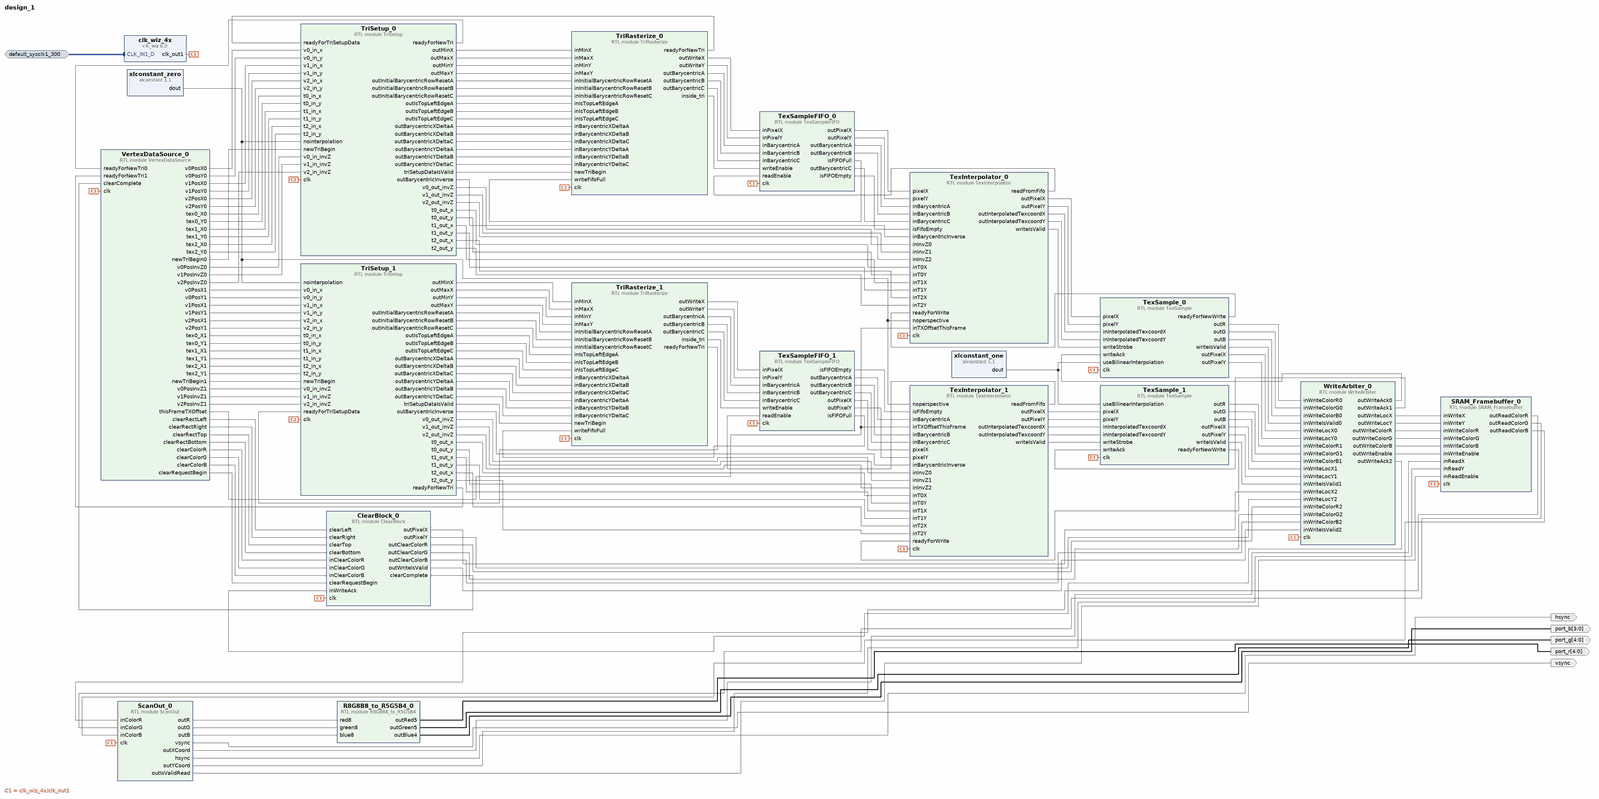
[diagram p0: block diagram of the top level, whole]
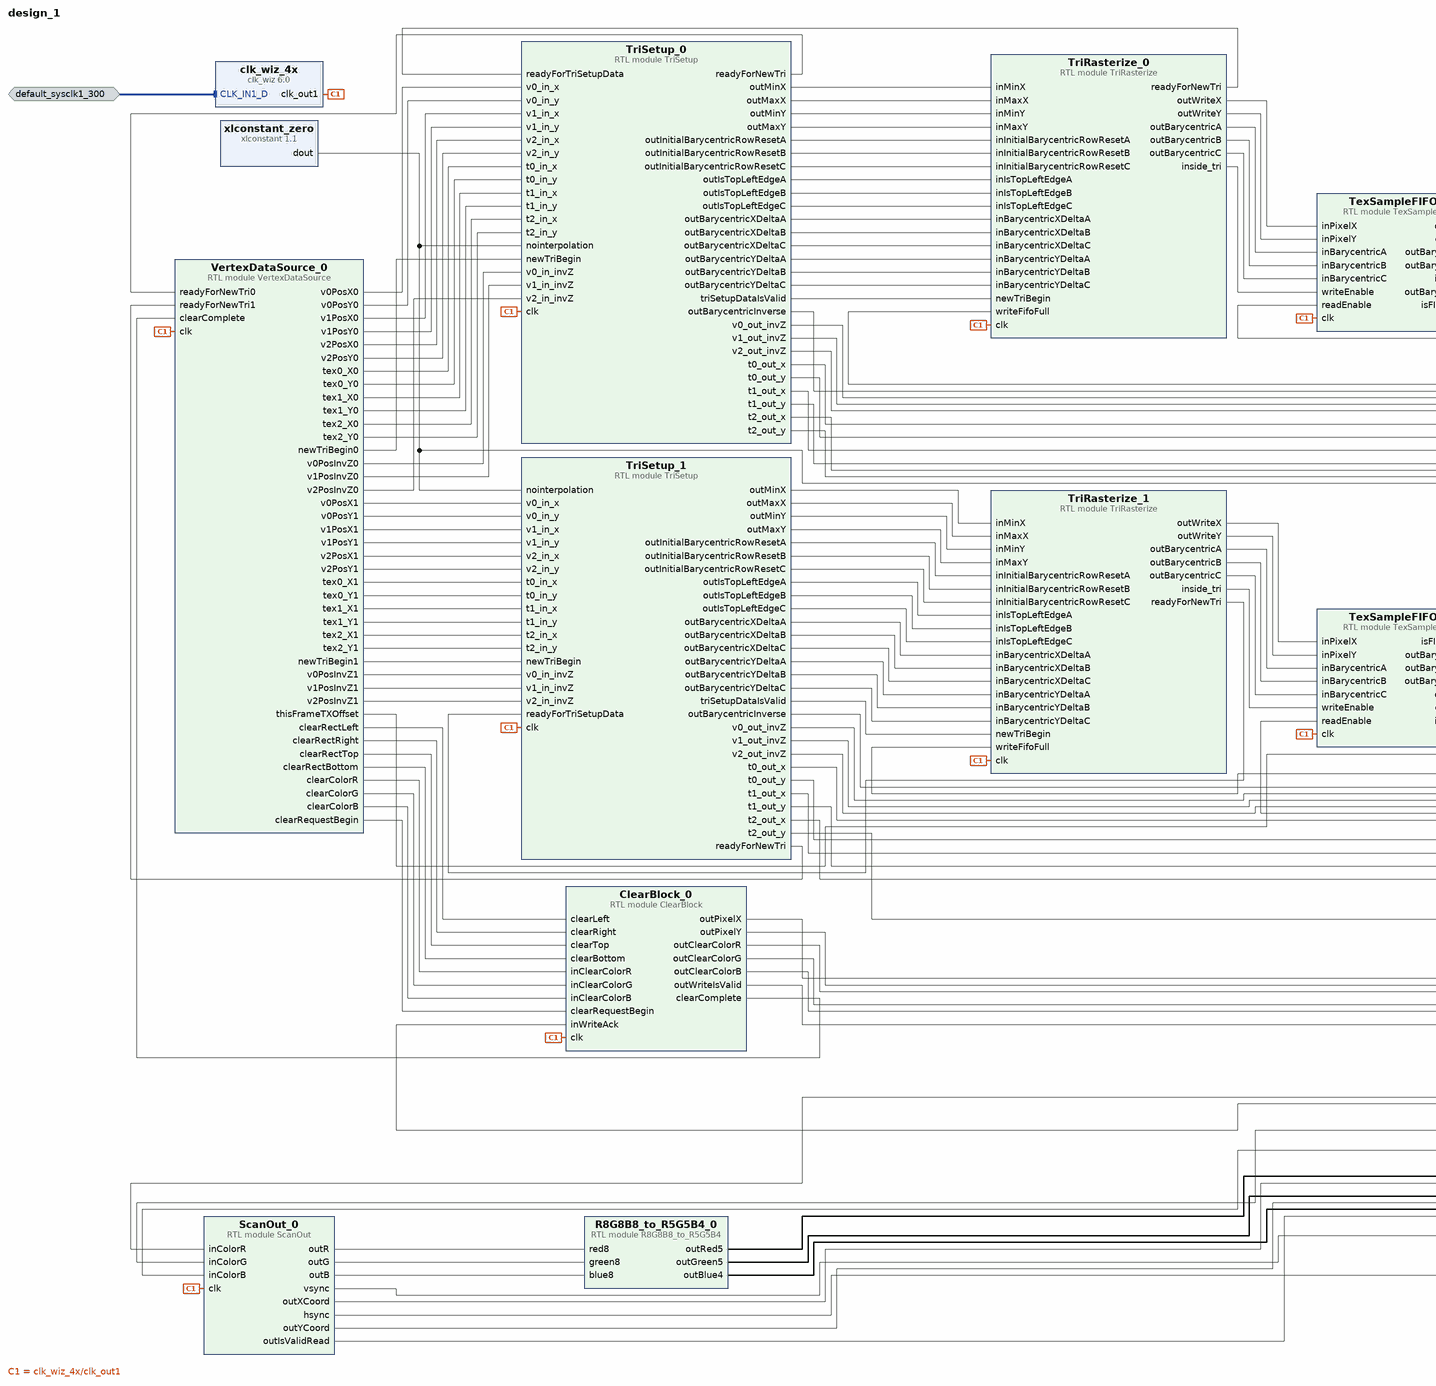
[diagram p1: block diagram of the top level, left part]
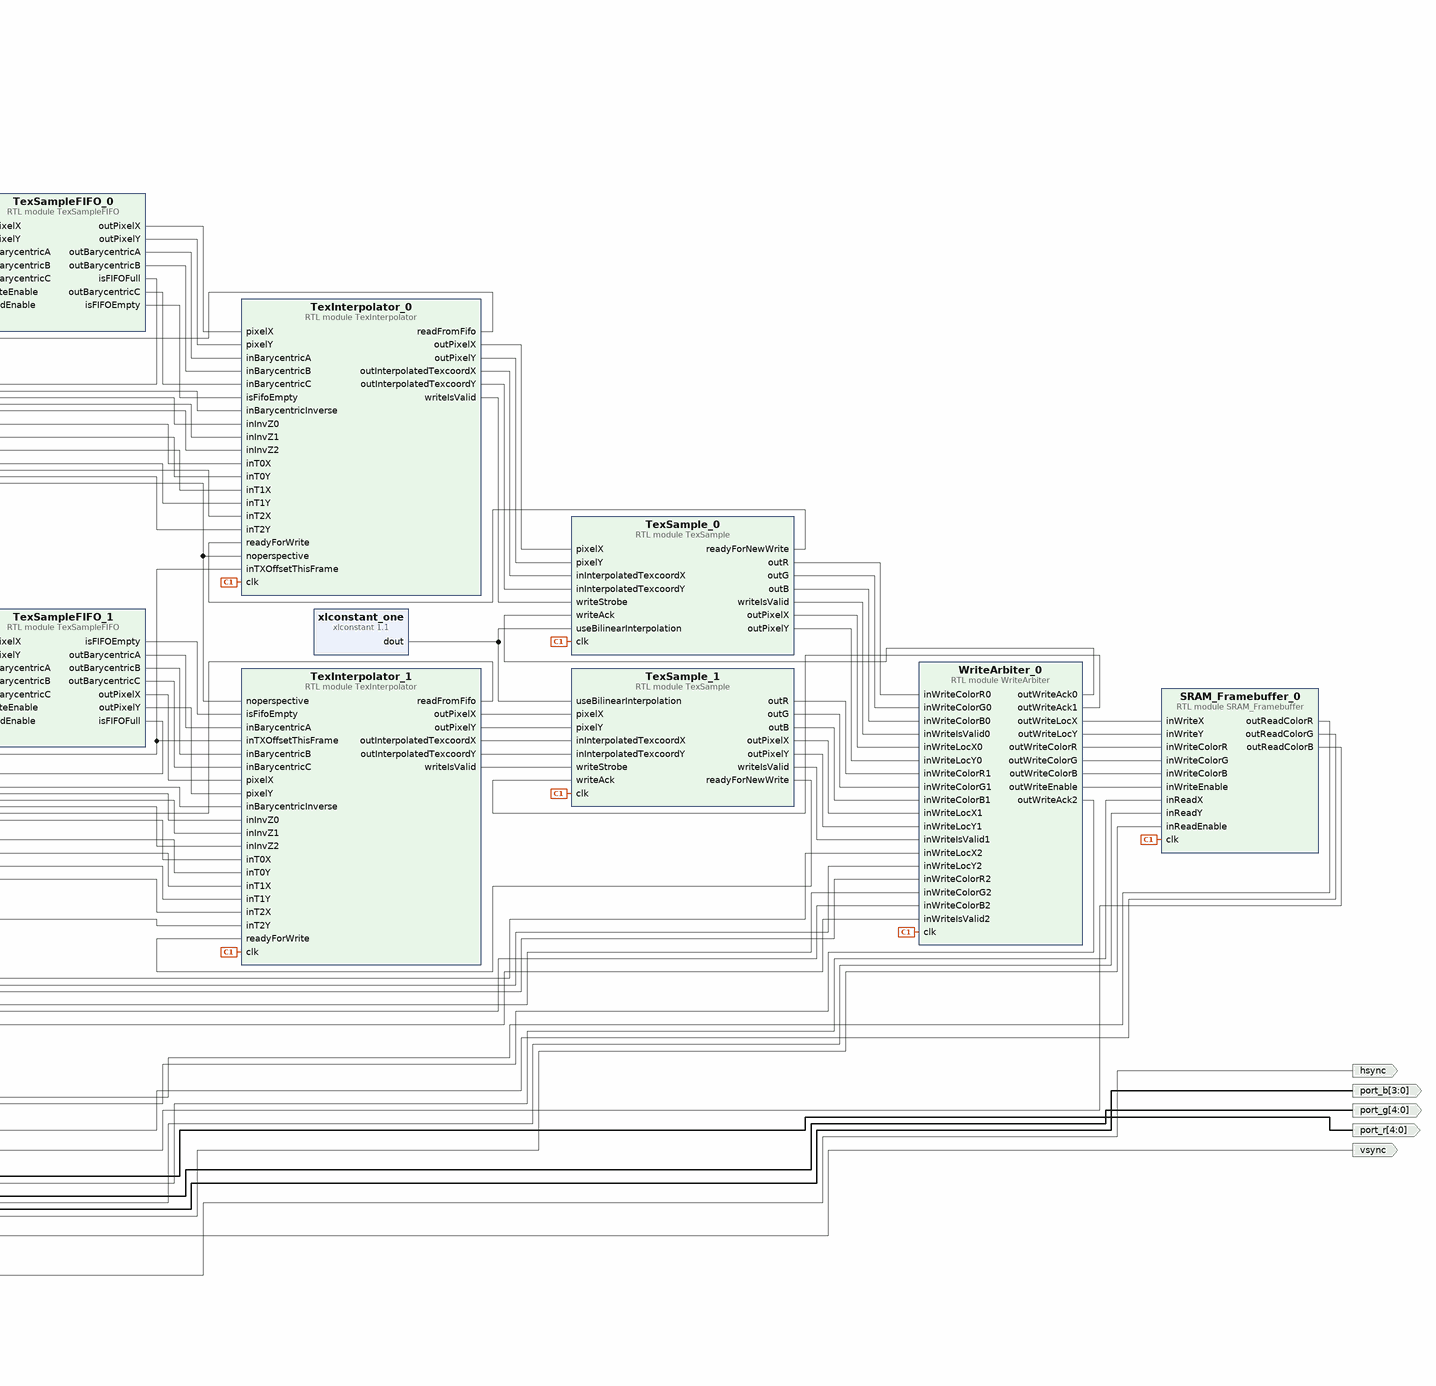
[diagram p2: block diagram of the top level, right part]
# Vivado block design design_1, xcku5p-ffvb676-2-e, Vivado 2018.1
create_bd_design design_1

create_bd_intf_port -mode Slave -vlnv xilinx.com:interface:diff_clock_rtl:1.0 default_sysclk1_300
set_property -dict {CONFIG.FREQ_HZ 300000000} [get_bd_intf_ports default_sysclk1_300]
create_bd_port -dir O -from 4 -to 0 -type data port_r
create_bd_port -dir O -from 4 -to 0 -type data port_g
create_bd_port -dir O -from 3 -to 0 -type data port_b
create_bd_port -dir O -type data vsync
create_bd_port -dir O -type data hsync

create_bd_cell -type ip -vlnv xilinx.com:ip:clk_wiz:6.0 clk_wiz_4x
set_property -dict [list \
  CONFIG.CLKIN1_JITTER_PS 33.330000000000005 \
  CONFIG.CLKOUT1_REQUESTED_OUT_FREQ 100.5 \
  CONFIG.PRIM_SOURCE Differential_clock_capable_pin \
  CONFIG.USE_LOCKED false \
  CONFIG.USE_RESET false \
  CONFIG.MMCM_DIVCLK_DIVIDE 25 \
  CONFIG.MMCM_CLKFBOUT_MULT_F 100.500 \
  CONFIG.MMCM_CLKIN1_PERIOD 3.333 \
  CONFIG.MMCM_CLKIN2_PERIOD 10.0 \
  CONFIG.MMCM_CLKOUT0_DIVIDE_F 12.000 \
  CONFIG.USE_BOARD_FLOW true \
  CONFIG.CLK_IN1_BOARD_INTERFACE default_sysclk1_300 \
  CONFIG.CLKOUT1_JITTER 205.181 \
  CONFIG.CLKOUT1_PHASE_ERROR 350.468 \
] [get_bd_cells clk_wiz_4x]
create_bd_cell -type module -reference R8G8B8_to_R5G5B4 R8G8B8_to_R5G5B4_0
create_bd_cell -type module -reference SRAM_Framebuffer SRAM_Framebuffer_0
create_bd_cell -type ip -vlnv xilinx.com:ip:xlconstant:1.1 xlconstant_zero
set_property -dict {CONFIG.CONST_VAL 0} [get_bd_cells xlconstant_zero]
create_bd_cell -type module -reference TexSampleFIFO TexSampleFIFO_0
create_bd_cell -type module -reference TexSampleFIFO TexSampleFIFO_1
create_bd_cell -type ip -vlnv xilinx.com:ip:xlconstant:1.1 xlconstant_one
create_bd_cell -type module -reference TriRasterize TriRasterize_0
create_bd_cell -type module -reference TriRasterize TriRasterize_1
create_bd_cell -type module -reference TriSetup TriSetup_0
create_bd_cell -type module -reference TriSetup TriSetup_1
create_bd_cell -type module -reference ScanOut ScanOut_0
create_bd_cell -type module -reference TexSample TexSample_0
create_bd_cell -type module -reference TexSample TexSample_1
create_bd_cell -type module -reference TexInterpolator TexInterpolator_0
create_bd_cell -type module -reference TexInterpolator TexInterpolator_1
create_bd_cell -type module -reference WriteArbiter WriteArbiter_0
create_bd_cell -type module -reference ClearBlock ClearBlock_0
create_bd_cell -type module -reference VertexDataSource VertexDataSource_0

# ---- connections ----

connect_bd_intf_net -intf_net default_sysclk1_300_1 [get_bd_intf_ports default_sysclk1_300] [get_bd_intf_pins clk_wiz_4x/CLK_IN1_D]
connect_bd_net [get_bd_pins R8G8B8_to_R5G5B4_0/outRed5] [get_bd_ports port_r]
connect_bd_net [get_bd_pins R8G8B8_to_R5G5B4_0/outGreen5] [get_bd_ports port_g]
connect_bd_net [get_bd_pins R8G8B8_to_R5G5B4_0/outBlue4] [get_bd_ports port_b]
connect_bd_net [get_bd_pins ScanOut_0/outR] [get_bd_pins R8G8B8_to_R5G5B4_0/red8]
connect_bd_net [get_bd_pins ScanOut_0/outG] [get_bd_pins R8G8B8_to_R5G5B4_0/green8]
connect_bd_net [get_bd_pins ScanOut_0/outB] [get_bd_pins R8G8B8_to_R5G5B4_0/blue8]
connect_bd_net [get_bd_pins ScanOut_0/vsync] [get_bd_ports vsync]
connect_bd_net [get_bd_pins ScanOut_0/hsync] [get_bd_ports hsync]
connect_bd_net [get_bd_pins SRAM_Framebuffer_0/outReadColorR] [get_bd_pins ScanOut_0/inColorR]
connect_bd_net [get_bd_pins SRAM_Framebuffer_0/outReadColorG] [get_bd_pins ScanOut_0/inColorG]
connect_bd_net [get_bd_pins SRAM_Framebuffer_0/outReadColorB] [get_bd_pins ScanOut_0/inColorB]
connect_bd_net [get_bd_pins ScanOut_0/outXCoord] [get_bd_pins SRAM_Framebuffer_0/inReadX]
connect_bd_net [get_bd_pins ScanOut_0/outYCoord] [get_bd_pins SRAM_Framebuffer_0/inReadY]
connect_bd_net [get_bd_pins ScanOut_0/outIsValidRead] [get_bd_pins SRAM_Framebuffer_0/inReadEnable]
connect_bd_net [get_bd_pins WriteArbiter_0/outWriteLocX] [get_bd_pins SRAM_Framebuffer_0/inWriteX]
connect_bd_net [get_bd_pins WriteArbiter_0/outWriteLocY] [get_bd_pins SRAM_Framebuffer_0/inWriteY]
connect_bd_net [get_bd_pins WriteArbiter_0/outWriteColorR] [get_bd_pins SRAM_Framebuffer_0/inWriteColorR]
connect_bd_net [get_bd_pins WriteArbiter_0/outWriteColorG] [get_bd_pins SRAM_Framebuffer_0/inWriteColorG]
connect_bd_net [get_bd_pins WriteArbiter_0/outWriteColorB] [get_bd_pins SRAM_Framebuffer_0/inWriteColorB]
connect_bd_net [get_bd_pins WriteArbiter_0/outWriteEnable] [get_bd_pins SRAM_Framebuffer_0/inWriteEnable]
connect_bd_net -net clk_wiz_0_clk_out1 [get_bd_pins clk_wiz_4x/clk_out1] \
  [get_bd_pins SRAM_Framebuffer_0/clk] [get_bd_pins TexSampleFIFO_0/clk] [get_bd_pins TexSampleFIFO_1/clk] \
  [get_bd_pins TriRasterize_0/clk] [get_bd_pins TriRasterize_1/clk] [get_bd_pins TriSetup_0/clk] [get_bd_pins TriSetup_1/clk] \
  [get_bd_pins ScanOut_0/clk] [get_bd_pins TexSample_0/clk] [get_bd_pins TexSample_1/clk] [get_bd_pins TexInterpolator_0/clk] \
  [get_bd_pins TexInterpolator_1/clk] [get_bd_pins WriteArbiter_0/clk] [get_bd_pins ClearBlock_0/clk] \
  [get_bd_pins VertexDataSource_0/clk]
connect_bd_net [get_bd_pins TexSample_0/outR] [get_bd_pins WriteArbiter_0/inWriteColorR0]
connect_bd_net [get_bd_pins TexSample_0/outG] [get_bd_pins WriteArbiter_0/inWriteColorG0]
connect_bd_net [get_bd_pins TexSample_0/outB] [get_bd_pins WriteArbiter_0/inWriteColorB0]
connect_bd_net [get_bd_pins TexSample_1/outR] [get_bd_pins WriteArbiter_0/inWriteColorR1]
connect_bd_net [get_bd_pins TexSample_1/outG] [get_bd_pins WriteArbiter_0/inWriteColorG1]
connect_bd_net [get_bd_pins TexSample_1/outB] [get_bd_pins WriteArbiter_0/inWriteColorB1]
connect_bd_net [get_bd_pins TexSample_0/writeIsValid] [get_bd_pins WriteArbiter_0/inWriteIsValid0]
connect_bd_net [get_bd_pins TexSample_0/outPixelX] [get_bd_pins WriteArbiter_0/inWriteLocX0]
connect_bd_net [get_bd_pins TexSample_0/outPixelY] [get_bd_pins WriteArbiter_0/inWriteLocY0]
connect_bd_net [get_bd_pins WriteArbiter_0/outWriteAck0] [get_bd_pins TexSample_0/writeAck]
connect_bd_net [get_bd_pins TexSample_1/outPixelX] [get_bd_pins WriteArbiter_0/inWriteLocX1]
connect_bd_net [get_bd_pins TexSample_1/outPixelY] [get_bd_pins WriteArbiter_0/inWriteLocY1]
connect_bd_net [get_bd_pins WriteArbiter_0/outWriteAck1] [get_bd_pins TexSample_1/writeAck]
connect_bd_net [get_bd_pins TexSample_1/writeIsValid] [get_bd_pins WriteArbiter_0/inWriteIsValid1]
connect_bd_net [get_bd_pins VertexDataSource_0/v0PosX0] [get_bd_pins TriSetup_0/v0_in_x]
connect_bd_net [get_bd_pins VertexDataSource_0/v0PosY0] [get_bd_pins TriSetup_0/v0_in_y]
connect_bd_net [get_bd_pins VertexDataSource_0/v1PosX0] [get_bd_pins TriSetup_0/v1_in_x]
connect_bd_net [get_bd_pins VertexDataSource_0/v1PosY0] [get_bd_pins TriSetup_0/v1_in_y]
connect_bd_net [get_bd_pins VertexDataSource_0/v2PosX0] [get_bd_pins TriSetup_0/v2_in_x]
connect_bd_net [get_bd_pins VertexDataSource_0/v2PosY0] [get_bd_pins TriSetup_0/v2_in_y]
connect_bd_net [get_bd_pins VertexDataSource_0/tex0_X0] [get_bd_pins TriSetup_0/t0_in_x]
connect_bd_net [get_bd_pins VertexDataSource_0/tex0_Y0] [get_bd_pins TriSetup_0/t0_in_y]
connect_bd_net [get_bd_pins VertexDataSource_0/tex1_X0] [get_bd_pins TriSetup_0/t1_in_x]
connect_bd_net [get_bd_pins VertexDataSource_0/tex1_Y0] [get_bd_pins TriSetup_0/t1_in_y]
connect_bd_net [get_bd_pins VertexDataSource_0/tex2_X0] [get_bd_pins TriSetup_0/t2_in_x]
connect_bd_net [get_bd_pins VertexDataSource_0/tex2_Y0] [get_bd_pins TriSetup_0/t2_in_y]
connect_bd_net [get_bd_pins VertexDataSource_0/newTriBegin0] [get_bd_pins TriSetup_0/newTriBegin]
connect_bd_net [get_bd_pins VertexDataSource_0/v0PosX1] [get_bd_pins TriSetup_1/v0_in_x]
connect_bd_net [get_bd_pins VertexDataSource_0/v0PosY1] [get_bd_pins TriSetup_1/v0_in_y]
connect_bd_net [get_bd_pins VertexDataSource_0/v1PosX1] [get_bd_pins TriSetup_1/v1_in_x]
connect_bd_net [get_bd_pins VertexDataSource_0/v1PosY1] [get_bd_pins TriSetup_1/v1_in_y]
connect_bd_net [get_bd_pins VertexDataSource_0/v2PosX1] [get_bd_pins TriSetup_1/v2_in_x]
connect_bd_net [get_bd_pins VertexDataSource_0/v2PosY1] [get_bd_pins TriSetup_1/v2_in_y]
connect_bd_net [get_bd_pins VertexDataSource_0/tex0_X1] [get_bd_pins TriSetup_1/t0_in_x]
connect_bd_net [get_bd_pins VertexDataSource_0/tex0_Y1] [get_bd_pins TriSetup_1/t0_in_y]
connect_bd_net [get_bd_pins VertexDataSource_0/tex1_X1] [get_bd_pins TriSetup_1/t1_in_x]
connect_bd_net [get_bd_pins VertexDataSource_0/tex1_Y1] [get_bd_pins TriSetup_1/t1_in_y]
connect_bd_net [get_bd_pins VertexDataSource_0/tex2_X1] [get_bd_pins TriSetup_1/t2_in_x]
connect_bd_net [get_bd_pins VertexDataSource_0/tex2_Y1] [get_bd_pins TriSetup_1/t2_in_y]
connect_bd_net [get_bd_pins VertexDataSource_0/newTriBegin1] [get_bd_pins TriSetup_1/newTriBegin]
connect_bd_net [get_bd_pins xlconstant_zero/dout] \
  [get_bd_pins TriSetup_0/nointerpolation] [get_bd_pins TriSetup_1/nointerpolation] \
  [get_bd_pins TexInterpolator_0/noperspective] [get_bd_pins TexInterpolator_1/noperspective]
connect_bd_net [get_bd_pins TriSetup_0/outMinX] [get_bd_pins TriRasterize_0/inMinX]
connect_bd_net [get_bd_pins TriSetup_0/outMaxX] [get_bd_pins TriRasterize_0/inMaxX]
connect_bd_net [get_bd_pins TriSetup_0/outMinY] [get_bd_pins TriRasterize_0/inMinY]
connect_bd_net [get_bd_pins TriSetup_0/outMaxY] [get_bd_pins TriRasterize_0/inMaxY]
connect_bd_net [get_bd_pins TriSetup_0/outInitialBarycentricRowResetA] [get_bd_pins TriRasterize_0/inInitialBarycentricRowResetA]
connect_bd_net [get_bd_pins TriSetup_0/outInitialBarycentricRowResetB] [get_bd_pins TriRasterize_0/inInitialBarycentricRowResetB]
connect_bd_net [get_bd_pins TriSetup_0/outInitialBarycentricRowResetC] [get_bd_pins TriRasterize_0/inInitialBarycentricRowResetC]
connect_bd_net [get_bd_pins TriSetup_0/outIsTopLeftEdgeA] [get_bd_pins TriRasterize_0/inIsTopLeftEdgeA]
connect_bd_net [get_bd_pins TriSetup_0/outIsTopLeftEdgeB] [get_bd_pins TriRasterize_0/inIsTopLeftEdgeB]
connect_bd_net [get_bd_pins TriSetup_0/outIsTopLeftEdgeC] [get_bd_pins TriRasterize_0/inIsTopLeftEdgeC]
connect_bd_net [get_bd_pins TriSetup_0/outBarycentricXDeltaA] [get_bd_pins TriRasterize_0/inBarycentricXDeltaA]
connect_bd_net [get_bd_pins TriSetup_0/outBarycentricXDeltaB] [get_bd_pins TriRasterize_0/inBarycentricXDeltaB]
connect_bd_net [get_bd_pins TriSetup_0/outBarycentricXDeltaC] [get_bd_pins TriRasterize_0/inBarycentricXDeltaC]
connect_bd_net [get_bd_pins TriSetup_0/outBarycentricYDeltaA] [get_bd_pins TriRasterize_0/inBarycentricYDeltaA]
connect_bd_net [get_bd_pins TriSetup_0/outBarycentricYDeltaB] [get_bd_pins TriRasterize_0/inBarycentricYDeltaB]
connect_bd_net [get_bd_pins TriSetup_0/outBarycentricYDeltaC] [get_bd_pins TriRasterize_0/inBarycentricYDeltaC]
connect_bd_net [get_bd_pins TriSetup_0/triSetupDataIsValid] [get_bd_pins TriRasterize_0/newTriBegin]
connect_bd_net [get_bd_pins TriRasterize_0/readyForNewTri] [get_bd_pins TriSetup_0/readyForTriSetupData]
connect_bd_net [get_bd_pins TriSetup_1/outMinX] [get_bd_pins TriRasterize_1/inMinX]
connect_bd_net [get_bd_pins TriSetup_1/outMaxX] [get_bd_pins TriRasterize_1/inMaxX]
connect_bd_net [get_bd_pins TriSetup_1/outMinY] [get_bd_pins TriRasterize_1/inMinY]
connect_bd_net [get_bd_pins TriSetup_1/outMaxY] [get_bd_pins TriRasterize_1/inMaxY]
connect_bd_net [get_bd_pins TriSetup_1/outInitialBarycentricRowResetA] [get_bd_pins TriRasterize_1/inInitialBarycentricRowResetA]
connect_bd_net [get_bd_pins TriSetup_1/outInitialBarycentricRowResetB] [get_bd_pins TriRasterize_1/inInitialBarycentricRowResetB]
connect_bd_net [get_bd_pins TriSetup_1/outInitialBarycentricRowResetC] [get_bd_pins TriRasterize_1/inInitialBarycentricRowResetC]
connect_bd_net [get_bd_pins TriSetup_1/outIsTopLeftEdgeA] [get_bd_pins TriRasterize_1/inIsTopLeftEdgeA]
connect_bd_net [get_bd_pins TriSetup_1/outIsTopLeftEdgeB] [get_bd_pins TriRasterize_1/inIsTopLeftEdgeB]
connect_bd_net [get_bd_pins TriSetup_1/outIsTopLeftEdgeC] [get_bd_pins TriRasterize_1/inIsTopLeftEdgeC]
connect_bd_net [get_bd_pins TriSetup_1/outBarycentricXDeltaA] [get_bd_pins TriRasterize_1/inBarycentricXDeltaA]
connect_bd_net [get_bd_pins TriSetup_1/outBarycentricXDeltaB] [get_bd_pins TriRasterize_1/inBarycentricXDeltaB]
connect_bd_net [get_bd_pins TriSetup_1/outBarycentricXDeltaC] [get_bd_pins TriRasterize_1/inBarycentricXDeltaC]
connect_bd_net [get_bd_pins TriSetup_1/outBarycentricYDeltaA] [get_bd_pins TriRasterize_1/inBarycentricYDeltaA]
connect_bd_net [get_bd_pins TriSetup_1/outBarycentricYDeltaB] [get_bd_pins TriRasterize_1/inBarycentricYDeltaB]
connect_bd_net [get_bd_pins TriSetup_1/outBarycentricYDeltaC] [get_bd_pins TriRasterize_1/inBarycentricYDeltaC]
connect_bd_net [get_bd_pins TriSetup_1/triSetupDataIsValid] [get_bd_pins TriRasterize_1/newTriBegin]
connect_bd_net [get_bd_pins TriRasterize_1/readyForNewTri] [get_bd_pins TriSetup_1/readyForTriSetupData]
connect_bd_net [get_bd_pins TriRasterize_1/outWriteX] [get_bd_pins TexSampleFIFO_1/inPixelX]
connect_bd_net [get_bd_pins TriRasterize_1/outWriteY] [get_bd_pins TexSampleFIFO_1/inPixelY]
connect_bd_net [get_bd_pins TriRasterize_1/outBarycentricA] [get_bd_pins TexSampleFIFO_1/inBarycentricA]
connect_bd_net [get_bd_pins TriRasterize_1/outBarycentricB] [get_bd_pins TexSampleFIFO_1/inBarycentricB]
connect_bd_net [get_bd_pins TriRasterize_1/outBarycentricC] [get_bd_pins TexSampleFIFO_1/inBarycentricC]
connect_bd_net [get_bd_pins TriRasterize_1/inside_tri] [get_bd_pins TexSampleFIFO_1/writeEnable]
connect_bd_net [get_bd_pins TriRasterize_0/outWriteX] [get_bd_pins TexSampleFIFO_0/inPixelX]
connect_bd_net [get_bd_pins TriRasterize_0/outWriteY] [get_bd_pins TexSampleFIFO_0/inPixelY]
connect_bd_net [get_bd_pins TriRasterize_0/outBarycentricA] [get_bd_pins TexSampleFIFO_0/inBarycentricA]
connect_bd_net [get_bd_pins TriRasterize_0/outBarycentricB] [get_bd_pins TexSampleFIFO_0/inBarycentricB]
connect_bd_net [get_bd_pins TriRasterize_0/outBarycentricC] [get_bd_pins TexSampleFIFO_0/inBarycentricC]
connect_bd_net [get_bd_pins TriRasterize_0/inside_tri] [get_bd_pins TexSampleFIFO_0/writeEnable]
connect_bd_net [get_bd_pins TexSampleFIFO_0/isFIFOFull] [get_bd_pins TriRasterize_0/writeFifoFull]
connect_bd_net [get_bd_pins TexSampleFIFO_1/isFIFOFull] [get_bd_pins TriRasterize_1/writeFifoFull]
connect_bd_net [get_bd_pins TriSetup_1/readyForNewTri] [get_bd_pins VertexDataSource_0/readyForNewTri1]
connect_bd_net [get_bd_pins TriSetup_0/readyForNewTri] [get_bd_pins VertexDataSource_0/readyForNewTri0]
connect_bd_net [get_bd_pins VertexDataSource_0/v0PosInvZ0] [get_bd_pins TriSetup_0/v0_in_invZ]
connect_bd_net [get_bd_pins VertexDataSource_0/v1PosInvZ0] [get_bd_pins TriSetup_0/v1_in_invZ]
connect_bd_net [get_bd_pins VertexDataSource_0/v2PosInvZ0] [get_bd_pins TriSetup_0/v2_in_invZ]
connect_bd_net [get_bd_pins VertexDataSource_0/v0PosInvZ1] [get_bd_pins TriSetup_1/v0_in_invZ]
connect_bd_net [get_bd_pins VertexDataSource_0/v1PosInvZ1] [get_bd_pins TriSetup_1/v1_in_invZ]
connect_bd_net [get_bd_pins VertexDataSource_0/v2PosInvZ1] [get_bd_pins TriSetup_1/v2_in_invZ]
connect_bd_net [get_bd_pins TexSampleFIFO_0/outPixelX] [get_bd_pins TexInterpolator_0/pixelX]
connect_bd_net [get_bd_pins TexSampleFIFO_0/outPixelY] [get_bd_pins TexInterpolator_0/pixelY]
connect_bd_net [get_bd_pins TexInterpolator_0/outPixelX] [get_bd_pins TexSample_0/pixelX]
connect_bd_net [get_bd_pins TexInterpolator_0/outPixelY] [get_bd_pins TexSample_0/pixelY]
connect_bd_net [get_bd_pins TexInterpolator_0/outInterpolatedTexcoordX] [get_bd_pins TexSample_0/inInterpolatedTexcoordX]
connect_bd_net [get_bd_pins TexInterpolator_0/outInterpolatedTexcoordY] [get_bd_pins TexSample_0/inInterpolatedTexcoordY]
connect_bd_net [get_bd_pins TexInterpolator_0/writeIsValid] [get_bd_pins TexSample_0/writeStrobe]
connect_bd_net [get_bd_pins TexSample_0/readyForNewWrite] [get_bd_pins TexInterpolator_0/readyForWrite]
connect_bd_net [get_bd_pins TexInterpolator_0/readFromFifo] [get_bd_pins TexSampleFIFO_0/readEnable]
connect_bd_net [get_bd_pins TexSampleFIFO_0/outBarycentricA] [get_bd_pins TexInterpolator_0/inBarycentricA]
connect_bd_net [get_bd_pins TexSampleFIFO_0/outBarycentricB] [get_bd_pins TexInterpolator_0/inBarycentricB]
connect_bd_net [get_bd_pins TexSampleFIFO_0/outBarycentricC] [get_bd_pins TexInterpolator_0/inBarycentricC]
connect_bd_net [get_bd_pins TexSampleFIFO_0/isFIFOEmpty] [get_bd_pins TexInterpolator_0/isFifoEmpty]
connect_bd_net [get_bd_pins TriSetup_0/outBarycentricInverse] [get_bd_pins TexInterpolator_0/inBarycentricInverse]
connect_bd_net [get_bd_pins TriSetup_0/v0_out_invZ] [get_bd_pins TexInterpolator_0/inInvZ0]
connect_bd_net [get_bd_pins TriSetup_0/v1_out_invZ] [get_bd_pins TexInterpolator_0/inInvZ1]
connect_bd_net [get_bd_pins TriSetup_0/v2_out_invZ] [get_bd_pins TexInterpolator_0/inInvZ2]
connect_bd_net [get_bd_pins TriSetup_0/t0_out_x] [get_bd_pins TexInterpolator_0/inT0X]
connect_bd_net [get_bd_pins TriSetup_0/t0_out_y] [get_bd_pins TexInterpolator_0/inT0Y]
connect_bd_net [get_bd_pins TriSetup_0/t1_out_x] [get_bd_pins TexInterpolator_0/inT1X]
connect_bd_net [get_bd_pins TriSetup_0/t1_out_y] [get_bd_pins TexInterpolator_0/inT1Y]
connect_bd_net [get_bd_pins TriSetup_0/t2_out_x] [get_bd_pins TexInterpolator_0/inT2X]
connect_bd_net [get_bd_pins TriSetup_0/t2_out_y] [get_bd_pins TexInterpolator_0/inT2Y]
connect_bd_net [get_bd_pins TexSampleFIFO_1/isFIFOEmpty] [get_bd_pins TexInterpolator_1/isFifoEmpty]
connect_bd_net [get_bd_pins TexSampleFIFO_1/outBarycentricA] [get_bd_pins TexInterpolator_1/inBarycentricA]
connect_bd_net [get_bd_pins TexSampleFIFO_1/outBarycentricB] [get_bd_pins TexInterpolator_1/inBarycentricB]
connect_bd_net [get_bd_pins TexSampleFIFO_1/outBarycentricC] [get_bd_pins TexInterpolator_1/inBarycentricC]
connect_bd_net [get_bd_pins TexSampleFIFO_1/outPixelX] [get_bd_pins TexInterpolator_1/pixelX]
connect_bd_net [get_bd_pins TexSampleFIFO_1/outPixelY] [get_bd_pins TexInterpolator_1/pixelY]
connect_bd_net [get_bd_pins TexInterpolator_1/outPixelX] [get_bd_pins TexSample_1/pixelX]
connect_bd_net [get_bd_pins TexInterpolator_1/outPixelY] [get_bd_pins TexSample_1/pixelY]
connect_bd_net [get_bd_pins TexInterpolator_1/outInterpolatedTexcoordX] [get_bd_pins TexSample_1/inInterpolatedTexcoordX]
connect_bd_net [get_bd_pins TexInterpolator_1/outInterpolatedTexcoordY] [get_bd_pins TexSample_1/inInterpolatedTexcoordY]
connect_bd_net [get_bd_pins TexInterpolator_1/writeIsValid] [get_bd_pins TexSample_1/writeStrobe]
connect_bd_net [get_bd_pins TexSample_1/readyForNewWrite] [get_bd_pins TexInterpolator_1/readyForWrite]
connect_bd_net [get_bd_pins TexInterpolator_1/readFromFifo] [get_bd_pins TexSampleFIFO_1/readEnable]
connect_bd_net [get_bd_pins TriSetup_1/outBarycentricInverse] [get_bd_pins TexInterpolator_1/inBarycentricInverse]
connect_bd_net [get_bd_pins TriSetup_1/v0_out_invZ] [get_bd_pins TexInterpolator_1/inInvZ0]
connect_bd_net [get_bd_pins TriSetup_1/v1_out_invZ] [get_bd_pins TexInterpolator_1/inInvZ1]
connect_bd_net [get_bd_pins TriSetup_1/v2_out_invZ] [get_bd_pins TexInterpolator_1/inInvZ2]
connect_bd_net [get_bd_pins TriSetup_1/t0_out_x] [get_bd_pins TexInterpolator_1/inT0X]
connect_bd_net [get_bd_pins TriSetup_1/t0_out_y] [get_bd_pins TexInterpolator_1/inT0Y]
connect_bd_net [get_bd_pins TriSetup_1/t1_out_x] [get_bd_pins TexInterpolator_1/inT1X]
connect_bd_net [get_bd_pins TriSetup_1/t1_out_y] [get_bd_pins TexInterpolator_1/inT1Y]
connect_bd_net [get_bd_pins TriSetup_1/t2_out_x] [get_bd_pins TexInterpolator_1/inT2X]
connect_bd_net [get_bd_pins TriSetup_1/t2_out_y] [get_bd_pins TexInterpolator_1/inT2Y]
connect_bd_net [get_bd_pins xlconstant_one/dout] [get_bd_pins TexSample_0/useBilinearInterpolation] [get_bd_pins TexSample_1/useBilinearInterpolation]
connect_bd_net [get_bd_pins VertexDataSource_0/thisFrameTXOffset] \
  [get_bd_pins TexInterpolator_0/inTXOffsetThisFrame] [get_bd_pins TexInterpolator_1/inTXOffsetThisFrame]
connect_bd_net [get_bd_pins ClearBlock_0/outPixelX] [get_bd_pins WriteArbiter_0/inWriteLocX2]
connect_bd_net [get_bd_pins ClearBlock_0/outPixelY] [get_bd_pins WriteArbiter_0/inWriteLocY2]
connect_bd_net [get_bd_pins ClearBlock_0/outClearColorR] [get_bd_pins WriteArbiter_0/inWriteColorR2]
connect_bd_net [get_bd_pins ClearBlock_0/outClearColorG] [get_bd_pins WriteArbiter_0/inWriteColorG2]
connect_bd_net [get_bd_pins ClearBlock_0/outClearColorB] [get_bd_pins WriteArbiter_0/inWriteColorB2]
connect_bd_net [get_bd_pins ClearBlock_0/outWriteIsValid] [get_bd_pins WriteArbiter_0/inWriteIsValid2]
connect_bd_net [get_bd_pins WriteArbiter_0/outWriteAck2] [get_bd_pins ClearBlock_0/inWriteAck]
connect_bd_net [get_bd_pins VertexDataSource_0/clearRectLeft] [get_bd_pins ClearBlock_0/clearLeft]
connect_bd_net [get_bd_pins VertexDataSource_0/clearRectRight] [get_bd_pins ClearBlock_0/clearRight]
connect_bd_net [get_bd_pins VertexDataSource_0/clearRectTop] [get_bd_pins ClearBlock_0/clearTop]
connect_bd_net [get_bd_pins VertexDataSource_0/clearRectBottom] [get_bd_pins ClearBlock_0/clearBottom]
connect_bd_net [get_bd_pins VertexDataSource_0/clearColorR] [get_bd_pins ClearBlock_0/inClearColorR]
connect_bd_net [get_bd_pins VertexDataSource_0/clearColorG] [get_bd_pins ClearBlock_0/inClearColorG]
connect_bd_net [get_bd_pins VertexDataSource_0/clearColorB] [get_bd_pins ClearBlock_0/inClearColorB]
connect_bd_net [get_bd_pins VertexDataSource_0/clearRequestBegin] [get_bd_pins ClearBlock_0/clearRequestBegin]
connect_bd_net [get_bd_pins ClearBlock_0/clearComplete] [get_bd_pins VertexDataSource_0/clearComplete]

validate_bd_design
save_bd_design
